# EAGLE design 0402-capacitor-shunt-2x (EAGLE 9.4.1)
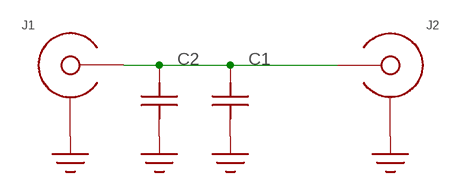
[diagram p0: schematic, sheet 1]

## Parts
C1  C  [C0402]
C2  C  [C0402]
J1  SMA-EDGE-LAUNCH4020_TAPER  [SMA_EDGE_LAUNCH_2L_4020_TAPER]
J2  SMA-EDGE-LAUNCHCUT-PIN  [SMA_EDGE_LAUNCH_2L_4020_CUT_PIN]

## Nets
GND: C1.1 C2.1 J1.BOTTOM_GND(SHIELD) J1.GND@1(SHIELD) J1.GND@2(SHIELD) J1.GND@3(SHIELD) J1.GND@4(SHIELD) J1.GND@5(SHIELD) J1.GND@6(SHIELD) J1.GND@7(SHIELD) J1.GND@8(SHIELD) J1.GND@14(SHIELD) J1.GND@15(SHIELD) J1.GND@16(SHIELD) J1.GND@17(SHIELD) J1.GND_PAD1(SHIELD) J1.GND_PAD2(SHIELD) J1.P$1(SHIELD) J1.P$2(SHIELD) J2.BOTTOM_GND(SHIELD) J2.GND@1(SHIELD) J2.GND@2(SHIELD) J2.GND@3(SHIELD) J2.GND@4(SHIELD) J2.GND@5(SHIELD) J2.GND@6(SHIELD) J2.GND@7(SHIELD) J2.GND@8(SHIELD) J2.GND@14(SHIELD) J2.GND@15(SHIELD) J2.GND@16(SHIELD) J2.GND@17(SHIELD) J2.GND_PAD1(SHIELD) J2.GND_PAD2(SHIELD)
N$1 [29-6]: C1.2 C2.2 J1.CENTER@1(CENTER) J2.CENTER@1(CENTER) J2.CENTER@3(CENTER)

## Library data of the parts
C1 C2 = yapo:C
J1 J2 = yapo:SMA-EDGE-LAUNCH

## Net classes
1 29-6: width 0.737 mm, clearance 0.152 mm

## Board
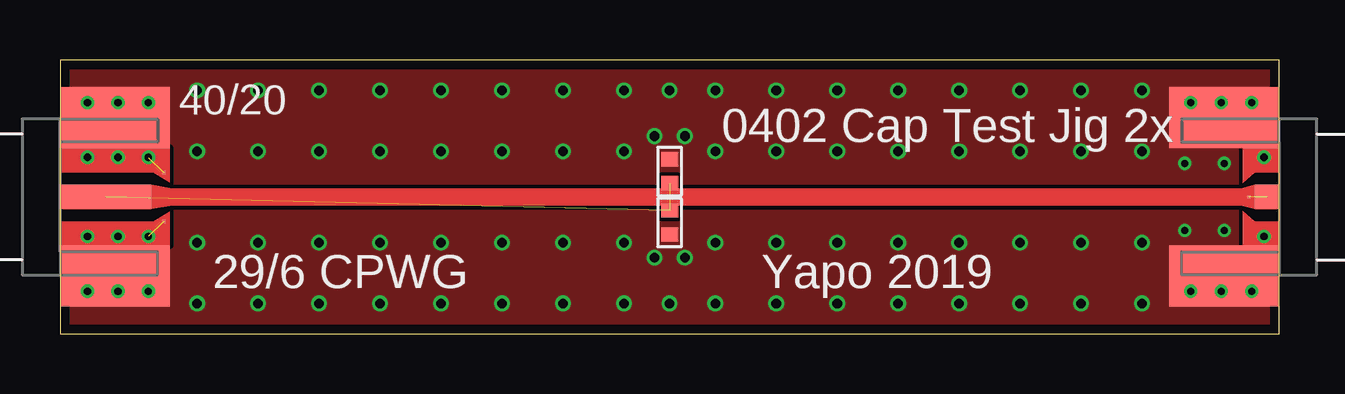
[diagram p1: board, top side]
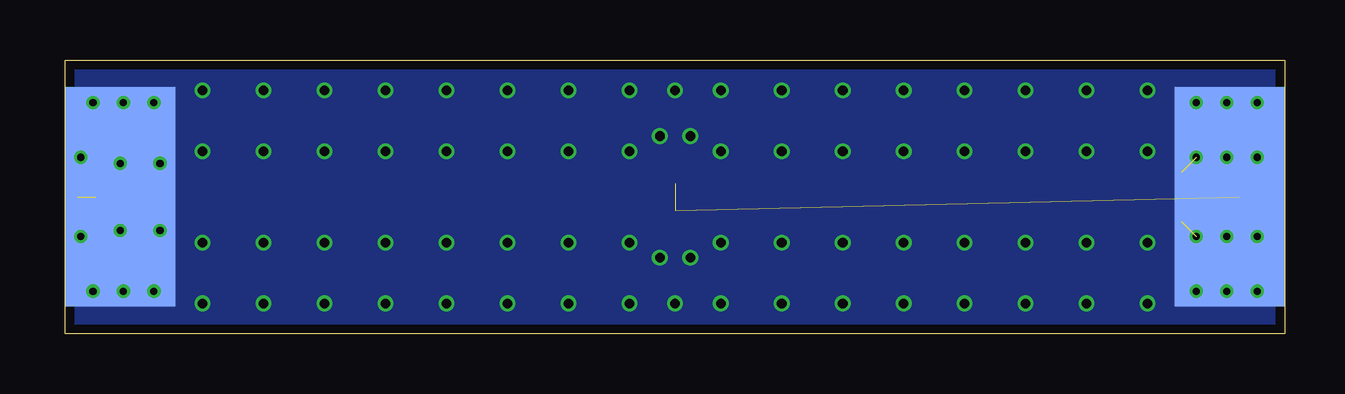
[diagram p2: board, bottom side, seen from below]

Size 50.8 x 11.43 mm. Coordinates in mm from the lower left corner, seen from the top.
Outline: 0,0 50.8,0 50.8,11.43 0,11.43 0,0
Copper layers (1*16): Top 0.035559375mm / dielectric 1.6mm / Bottom 0.035559375mm
Design rules "oshpark-2layer *": minimum track width 6mil, minimum drill 10mil, track to track 6mil, track to pad 6mil, pad to pad 6mil, via to via 6mil, smd to smd 6mil, copper to edge 15mil, drill to drill 6mil, minimum pad ring 5mil, minimum via ring 5mil, stop-mask expansion 2.5mil, vias tented up to drill 20mil, thermal gap 10mil

### Footprints (pad centres in the part's own frame; a part is rotated, then mirrored left to right if it is on the bottom)
C0402 = smd 0.6 x 0.7: 1 -0.5,0; 2 0.5,0
SMA_EDGE_LAUNCH_2L_4020_TAPER = smd 4.572 x 9.144 bottom: BOTTOM_GND 2.286,0 | smd 3.81 x 1.016: CENTER@1 1.905,0 | drill 0.3: GND@1 1.143,3.937; GND@2 3.683,3.937; GND@3 1.143,1.651; GND@4 3.683,1.651; GND@5 1.143,-1.651; GND@6 3.683,-1.651; GND@7 1.143,-3.937; GND@8 3.683,-3.937; GND@14 2.413,3.937; GND@15 2.413,-3.937; GND@16 2.413,-1.651; GND@17 2.413,1.651 | smd 4.572 x 2.54: GND_PAD1 2.286,3.302; GND_PAD2 2.286,-3.302 | smd 0.127 x 0.127: P$1 4.318,1.016; P$2 4.318,-1.016
SMA_EDGE_LAUNCH_2L_4020_CUT_PIN = smd 4.572 x 9.144 bottom: BOTTOM_GND 2.286,0 | smd 1.016 x 1.016: CENTER@1 0.508,0 | smd 0.127 x 0.127: CENTER@3 1.27,0 | drill 0.3: GND@1 1.143,3.937; GND@2 3.683,3.937; GND@3 0.635,1.651; GND@4 3.937,1.397; GND@5 3.937,-1.397; GND@6 0.635,-1.651; GND@7 1.143,-3.937; GND@8 3.683,-3.937; GND@14 2.413,3.937; GND@15 2.413,-3.937; GND@16 2.286,-1.397; GND@17 2.286,1.397 | smd 4.572 x 2.54: GND_PAD1 2.286,3.302; GND_PAD2 2.286,-3.302

### Placement (x,y rotation side)
C1  25.4,4.65 90 top
C2  25.4,6.78 270 top
J1  0,5.71 0 top
J2  50.8,5.71 180 top

### Tracks (layer width: path | path; a pad name or v marks a point on that pad's centre or on a via)
GND  (via drill 0.4)  (2 unrouted)
  other vias: 5.71,7.62 5.71,3.81 8.26,7.62 10.79,7.62 13.34,7.62 15.88,7.62 18.41,7.62 20.95,7.62 23.5,7.62 27.3,7.62 8.26,3.81 10.79,3.81 13.34,3.81 18.41,3.81 20.95,3.81 23.5,3.81 27.3,3.81 5.71,10.16 5.71,1.27 8.26,10.16 10.79,10.16 13.34,10.16 15.88,10.16 18.41,10.16 20.95,10.16 23.5,10.16 27.3,10.16 8.26,1.27 10.79,1.27 13.34,1.27 18.41,1.27 15.88,1.27 20.95,1.27 23.5,1.27 27.3,1.27 29.84,7.62 32.38,7.62 34.92,7.62 37.47,7.62 40.01,7.62 42.55,7.62 29.84,1.27 32.38,1.27 34.92,1.27 37.47,1.27 42.55,1.27 40.01,1.27 45.09,1.27 45.09,7.62 29.84,10.16 32.38,10.16 34.92,10.16 37.47,10.16 40.01,10.16 42.55,10.16 45.09,10.16 29.84,3.81 32.38,3.81 34.92,3.81 37.47,3.81 40.01,3.81 42.55,3.81 45.09,3.81 15.88,3.81 25.4,10.16 25.4,1.27 24.77,3.17 24.77,8.26 26.04,8.26 26.04,3.17
  pour Top (no thermals): 0,0 50.8,0 50.8,11.43 0,11.43
  pour Bottom (no thermals): 0,0 50.8,0 50.8,11.43 0,11.43
N$1  (3 unrouted)
  Top 0.737: J1.CENTER@1 J2.CENTER@1

### Text on the board
tPlace: 0402 Cap Test Jig 2x | 29/6 CPWG | Yapo 2019